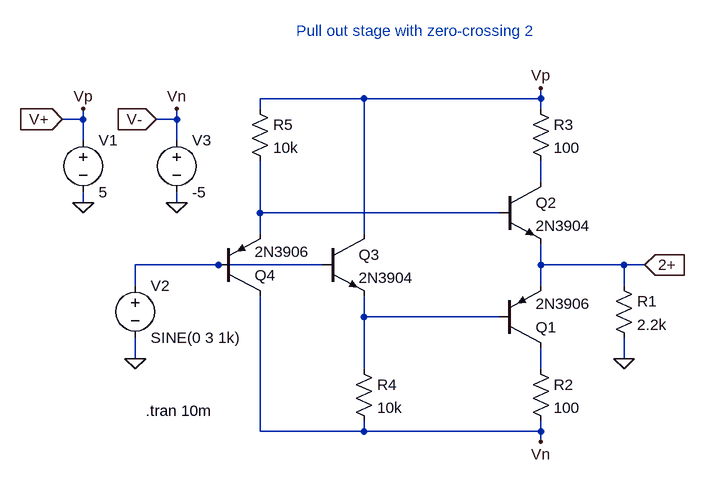
[diagram p0: schematic pull_out_zero_cross2.asc]
pull_out_zero_cross2.asc, the LTspice schematic file:
Version 4
SHEET 1 880 680
WIRE -80 -400 -240 -400
WIRE 192 -400 192 -416
WIRE 192 -400 -80 -400
WIRE -240 -384 -240 -400
WIRE 192 -384 192 -400
WIRE -512 -368 -512 -384
WIRE -512 -368 -544 -368
WIRE -368 -368 -368 -384
WIRE -368 -368 -400 -368
WIRE -512 -336 -512 -368
WIRE -368 -336 -368 -368
WIRE 192 -272 192 -304
WIRE -512 -240 -512 -256
WIRE -368 -240 -368 -256
WIRE -240 -224 -240 -304
WIRE 128 -224 -240 -224
WIRE -240 -192 -240 -224
WIRE -80 -192 -80 -400
WIRE -304 -144 -432 -144
WIRE -144 -144 -304 -144
WIRE 192 -144 192 -176
WIRE 320 -144 192 -144
WIRE 352 -144 320 -144
WIRE -432 -112 -432 -144
WIRE 192 -112 192 -144
WIRE 320 -112 320 -144
WIRE -80 -64 -80 -96
WIRE 128 -64 -80 -64
WIRE -432 0 -432 -32
WIRE 320 0 320 -32
WIRE -80 16 -80 -64
WIRE 192 16 192 -16
WIRE -240 112 -240 -96
WIRE -80 112 -80 96
WIRE -80 112 -240 112
WIRE 192 112 192 96
WIRE 192 112 -80 112
WIRE 192 128 192 112
FLAG 320 0 0
FLAG -512 -240 0
FLAG -512 -384 Vp
FLAG 192 -416 Vp
FLAG -432 0 0
FLAG -544 -368 V+
IOPIN -544 -368 In
FLAG 352 -144 2+
IOPIN 352 -144 In
FLAG -368 -240 0
FLAG -368 -384 Vn
FLAG -400 -368 V-
IOPIN -400 -368 In
FLAG 192 128 Vn
SYMBOL pnp 128 -16 M180
SYMATTR InstName Q1
SYMATTR Value 2N3906
SYMBOL npn 128 -272 R0
SYMATTR InstName Q2
SYMATTR Value 2N3904
SYMBOL res 304 -128 R0
SYMATTR InstName R1
SYMATTR Value 2.2k
SYMBOL res 176 0 R0
SYMATTR InstName R2
SYMATTR Value 100
SYMBOL res 176 -400 R0
SYMATTR InstName R3
SYMATTR Value 100
SYMBOL voltage -512 -352 R0
WINDOW 123 0 0 Left 0
WINDOW 39 0 0 Left 0
SYMATTR InstName V1
SYMATTR Value 5
SYMBOL voltage -432 -128 R0
WINDOW 123 0 0 Left 0
WINDOW 39 0 0 Left 0
SYMATTR InstName V2
SYMATTR Value SINE(0 3 1k)
SYMBOL voltage -368 -352 R0
WINDOW 123 0 0 Left 0
WINDOW 39 0 0 Left 0
SYMATTR InstName V3
SYMATTR Value -5
SYMBOL npn -144 -192 R0
SYMATTR InstName Q3
SYMATTR Value 2N3904
SYMBOL pnp -304 -96 M180
SYMATTR InstName Q4
SYMATTR Value 2N3906
SYMBOL res -96 0 R0
SYMATTR InstName R4
SYMATTR Value 10k
SYMBOL res -256 -400 R0
SYMATTR InstName R5
SYMATTR Value 10k
TEXT -416 80 Left 2 !.tran 10m
TEXT -184 -504 Left 2 ;Pull out stage with zero-crossing 2

The netlist it stands for:
* pull_out_zero_cross2.asc
Q1 N005 N004 2+ 0 2N3906
Q2 N001 N002 2+ 0 2N3904
R1 2+ 0 2.2k
R2 N005 V- 100
R3 V+ N001 100
V1 V+ 0 5
V2 N003 0 SINE(0 3 1k)
V3 V- 0 -5
Q3 V+ N003 N004 0 2N3904
Q4 V- N003 N002 0 2N3906
R4 N004 V- 10k
R5 V+ N002 10k
.model NPN NPN
.model PNP PNP
.lib standard.bjt
.tran 10m
* Pull out stage with zero-crossing 2
.backanno
.end